# Altium schematic sheet SH1 - POWER.SchDoc: Power
size Letter; DrawnBy: Ayesha Ebrahim; SheetNumber: 5; SheetTotal: 6
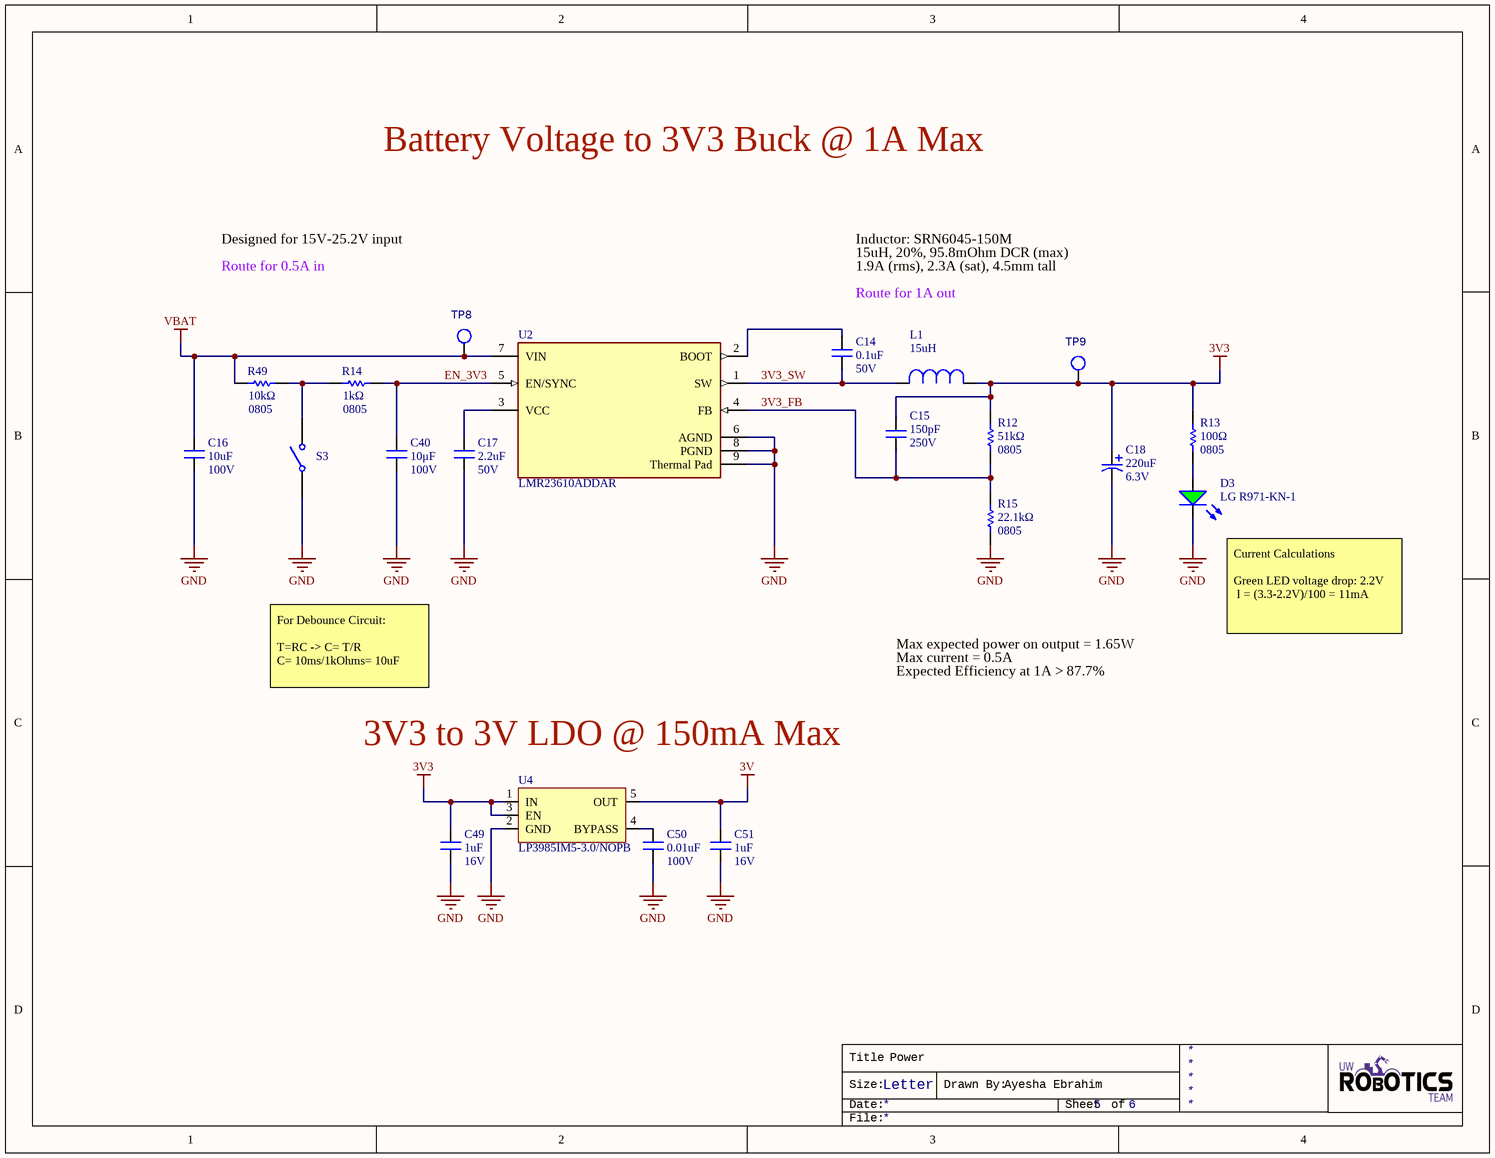
[diagram p0: SH1 - POWER.SchDoc]

## Parts
C14  value 0.1uF  Voltage Rating: 50V  [CAPC2012X140N]  (hidden comment: CAP_0.1uF_50V_0805)
C15  value 150pF  Voltage Rating: 250V  [CAPC2012X140N]  (hidden comment: CAP_150pF_250V_0805)
C16  value 10uF  Voltage Rating: 100V  [CAPC1210(3225)]  (hidden comment: CAP_10uF_100V_1210)
C17  value 2.2uF  Voltage Rating: 50V  [CAPC1206(3216)]  (hidden comment: CAP_2.2uF_50V_1206)
C18  value 220uF  Voltage Rating: 6.3V  [PCAP_SVP_B6_PA00]  (hidden comment: CAP_220uF_6.3V_SMD)
C40  value 10μF  Voltage Rating: 100V  [CAPC1210(3225)]  (hidden comment: CAP_10uF_100V_1210)
C49  value 1uF  Voltage Rating: 16V  [CAPC2012X140N]  (hidden comment: CAP_1uF_16V_0805)
C50  value 0.01uF  Voltage Rating: 100V  [CAPC2012X140N]  (hidden comment: CAP_0.01uF_100V_0805)
C51  value 1uF  Voltage Rating: 16V  [CAPC2012X140N]  (hidden comment: CAP_1uF_16V_0805)
D3  Manufacturer Part Number 1: LG R971-KN-1  [LED_0805_LINE]  (hidden comment: DIO_LED_G)
L1  Inductance: 15uH  [IND_BOURNS_SRN6045]  (hidden comment: SRN6045-150M)
R12  value 51kΩ  Case Code (Imperial): 0805  [RESC2012X60N]  (hidden comment: RES_51kΩ_0805)
R13  value 100Ω  Case Code (Imperial): 0805  [RESC2012X60N]  (hidden comment: RES_100Ω_0805)
R14  value 1kΩ  Case Code (Imperial): 0805  [RESC2012X60N]
R15  Case Code (Imperial): 0805  Resistance: 22.1kΩ  [RESC2012X60N]  (hidden comment: RES_22.1kΩ_0805)
R49  value 10kΩ  Case Code (Imperial): 0805  [RESC2012X60N]  (hidden comment: RES_10kΩ_0805)
S3  GF-123-0054  [GF1230054]  (value not drawn)
TP8  TESTPOINT_LOOP  [TESTPOINT_LOOP]  (value not drawn)
TP9  TESTPOINT_LOOP  [TESTPOINT_LOOP]  (value not drawn)
U2  LMR23610ADDAR  [8-SO PowerPad]
U4  LP3985IM5-3.0/NOPB  [SOT23-5]

## Nets
3V: C51.2 U4.5(OUT)
3V3: C15.1 C18.1 C49.2 L1.1 R12.2 R13.2 TP9.1 U4.1(IN) U4.3(EN)
GND: C16.1 C17.1 C18.2 C40.1 C49.1 C50.1 C51.1 D3.2(K) R15.1 S3.1 U2.6(AGND) U2.8(PGND) U2.9(Thermal_Pad) U4.2(GND)
VBAT: C16.2 R49.1 TP8.1 U2.7(VIN)
3V3_FB: C15.2 R12.1 R15.2 U2.4(FB)
3V3_SW: C14.1 L1.2 U2.1(SW)
EN_3V3: C40.2 R14.2 U2.5(EN/SYNC)
NetC14_2: C14.2 U2.2(BOOT)
NetC17_2: C17.2 U2.3(VCC)
NetC50_2: C50.2 U4.4(BYPASS)
NetD3_1: D3.1(A) R13.1
NetR14_1: R14.1 R49.2 S3.2

## Notes on the sheet
- Battery Voltage to 3V3 Buck @ 1A Max
- Designed for 15V-25.2V input
- Route for 0.5A in
- Inductor: SRN6045-150M
- 15uH, 20%, 95.8mOhm DCR (max)
- 1.9A (rms), 2.3A (sat), 4.5mm tall
- (near C14) Route for 1A out
- (near D3) Current Calculations
  Green LED voltage drop: 2.2V
  I = (3.3-2.2V)/100 = 11mA
- For Debounce Circuit:
  T=RC -> C= T/R
  C= 10ms/1kOhms= 10uF
- Max expected power on output = 1.65W
- Max current = 0.5A
- Expected Efficiency at 1A > 87.7%
- (near U4) 3V3 to 3V LDO @ 150mA Max
- Title
- Size:
- Date:
- Letter
- Drawn By:
- Sheet
- of
- File:

## Library data of the parts
C14 = CAP_0.1uF_50V_0805: CAP CER 0.1UF 50V X7R 0805; Manufacturer 1: Murata Electronics; Manufacturer Part Number 1: GCD21BR71H104KA01L; Capacitance: 100nF; Tolerance: 10%; Mount: Surface Mount; Case/Package: 0805; Case Code (Metric): 2012; Case Code (Imperial): 0805; Min Operating Temperature: -55°C; Max Operating Temperature: 125°C; Dielectric: X7R; Termination: SMD/SMT; Length: 2mm; Height: 1.25mm; Width: 0.049inch; Thickness: 0.049inch; Depth: 1.25mm; Ratings: AEC-Q200; ComponentLink1URL: https://datasheet.ciiva.com/29537/c03e-29537701.pdf?src-supplier=Digi-Key; ComponentLink1Description: https://datasheet.ciiva.com/29537/c03e-29537701.pdf?src-supplier=Digi-Key; Supplier 1: Digi-Key; Supplier Part Number 1: 490-11955-1-ND
C15 = CAP_150pF_250V_0805: CAP CER 150PF 250V C0G/NP0 0805; Manufacturer 1: Murata Electronics; Manufacturer Part Number 1: GRM21A5C2E151JW01D; Tolerance: 5%; Dielectric: C0G, NP0; Mount: Surface Mount; Case/Package: 0805; Case Code (Metric): 2012; Case Code (Imperial): 0805; Min Operating Temperature: -55°C; Max Operating Temperature: 125°C; Capacitance: 150pF; Termination: SMD/SMT; Width: 0.049inch; Supplier 1: Digi-Key; Supplier Part Number 1: 490-12755-1-ND
C16 = CAP_10uF_100V_1210: CAP CER 10UF 100V X7S 1210; Manufacturer Part Number 1: GRM32EC72A106KE05L; Manufacturer 1: Murata Electronics; Package: 1210 (3225 Metric); Temperature Coefficient: X7S; Supplier Part Number 1: 490-16266-2-ND; Supplier 1: Digi-Key; Mount: Surface Mount
C17 = CAP_2.2uF_50V_1206: CAP CER 2.2UF 50V X7R 1206; Manufacturer 1: Murata Electronics; Manufacturer Part Number 1: GCM31CR71H225KA55L; Tolerance: 10%; Supplier Part Number 1: 490-4796-1-ND; Supplier 1: Digi-Key; RoHS: Yes; Category: Ceramic Capacitors; Stock 2: 102080; Pricing 2: 1=0.54000, 10=0.38400, 100=0.25300, 500=0.18742, 1000=0.15931 (USD); Case/Package: 1206; Case Code (Imperial): 1206; Case Code (Metric): 3216; Min Operating Temperature: -55°C; Max Operating Temperature: 125°C; Capacitance: 2.2uF; Dielectric: X7R; Packaging: Tape and Reel; Voltage Rating (DC): 50V; Package Quantity: 1; Termination: SMD/SMT; Voltage: 50V; Length: 3.2mm; Height: 1.6mm; Width: 1.6mm; Thickness: 0.071inch; Depth: 1.6mm; Ratings: AEC-Q200; Radiation Hardening: No; REACH SVHC: No SVHC; Lead Free: Lead Free
C18 = CAP_220uF_6.3V_SMD: CAP ALUM POLY 220UF 20% 6.3V SMD; Manufacturer Part Number 1: 6SVPE220MW; Manufacturer 1: Panasonic Electronic Components; Package: Radial, Can - SMD; Supplier Part Number 1: P16836CT-ND; Supplier 1: Digi-Key; Mount: Surface Mount
C40 = CAP_10uF_100V_1210: CAP CER 10uF 100V X7S 10% 1210; Manufacturer 1: Murata; Manufacturer Part Number 1: GRM32EC72A106KE05L; Supplier 1: Digi-Key; Category: Ceramic Capacitors; Mount: Surface Mount; Case Code (Imperial): 1210; Case Code (Metric): 3225; Min Operating Temperature: -55°C; Max Operating Temperature: 125°C; Tolerance: 10%; Supplier Part Number 1: 490-16266-1-ND; Dielectric: X7S; Package: 1210 (3225 Metric)
C49 C51 = CAP_1uF_16V_0805: CAP CER 1UF 16V X7R 0805; Manufacturer 1: Yageo; Manufacturer Part Number 1: CC0805KKX7R7BB105; Tolerance: 10%; Mount: Surface Mount; Case/Package: 0805; Case Code (Metric): 2012; Case Code (Imperial): 0805; Min Operating Temperature: -55°C; Max Operating Temperature: 125°C; Capacitance: 1uF; Dielectric: X7R; Termination: SMD/SMT; Supplier 1: Digi-Key; Supplier Part Number 1: 311-1365-1-ND
C50 = CAP_0.01uF_100V_0805: CAP CER 10000PF 100V X7R 0805; Manufacturer 1: KEMET; Manufacturer Part Number 1: C0805C103K1RACTU; Tolerance: 10%; Mount: Surface Mount; Case/Package: 0805; Case Code (Metric): 2012; Case Code (Imperial): 0805; Min Operating Temperature: -55°C; Max Operating Temperature: 125°C; Dielectric: X7R; Termination: SMD/SMT; Supplier 1: Digi-Key; Supplier Part Number 1: 399-1159-1-ND
D3 = DIO_LED_G: LED GREEN DIFFUSED 0805 SMD; Manufacturer 1: OSRAM; Forward Voltage Drop: 2.2V; Package: 0805 (2012 Metric); Supplier Part Number 1: 475-1410-1-ND; Supplier 1: Digi-Key; Mount: Surface Mount
L1 = IND_15uH_1.9A: FIXED IND 15UH 1.9A 95.8MOHM SMD; Manufacturer 1: Bourns Inc.; Core Material: Ferrite; DC Resistance (DCR): 95.8mR; Tolerance: 20%; Test Frequency: 100kHz; Shielding: Shielded; Saturation Current: 2.3A; Self Resonant Frequency: 13MHz; Supplier 1: Digi-Key; Manufacturer Part Number 1: SRN6045-150M; RoHS: Yes; Category: Fixed Inductors; Stock 1: 16841; Pricing 1: 1=0.60000, 10=0.52300, 100=0.37380, 500=0.31396 (USD); Mount: Surface Mount; Case/Package: Nonstandard; Number of Pins: 2; Weight: 0.027725oz; Min Operating Temperature: -40°C; Max Operating Temperature: 125°C; Max DC Current: 1.9A; Packaging: Tape and Reel; Termination: SMD/SMT; Composition: Wirewound; DC Current: 1.9A; Military Standard: Not; RMS Current (Irms): 1.9A; Inductance Tolerance: 20%; Package Quantity: 1000; Current Rating: 1.9A; Length: 6mm; Height: 4.5mm; Depth: 6.2mm; Height - Seated (Max): 0.177inch; Width: 6mm; REACH SVHC: No SVHC; ComponentLink1URL: https://datasheet.ciiva.com/5986/1705518-5986195.pdf?src-supplier=Farnell; ComponentLink1Description: https://datasheet.ciiva.com/5986/1705518-5986195.pdf?src-supplier=Farnell; ComponentLink2URL: https://datasheet.ciiva.com/11802/0900766b80fe1f3e-11802573.pdf?src-supplier=RSComponents; ComponentLink2Description: https://datasheet.ciiva.com/11802/0900766b80fe1f3e-11802573.pdf?src-supplier=RSComponents; ComponentLink3URL: https://datasheet.ciiva.com/1056/srn6045-1056107.pdf?src-supplier=Digi-Key; ComponentLink3Description: https://datasheet.ciiva.com/1056/srn6045-1056107.pdf?src-supplier=Digi-Key; ComponentLink4URL: https://datasheet.ciiva.com/8512/srn6045-8512989.pdf?src-supplier=Avnet; ComponentLink4Description: https://datasheet.ciiva.com/8512/srn6045-8512989.pdf?src-supplier=Avnet; ComponentLink5URL: https://datasheet.ciiva.com/17113/70231653-17113165.pdf?src-supplier=Allied+Electronics; ComponentLink5Description: https://datasheet.ciiva.com/17113/70231653-17113165.pdf?src-supplier=Allied+Electronics; ComponentLink6URL: https://datasheet.ciiva.com/17284/srn6045-17284750.pdf?src-supplier=Avnet+Europe; ComponentLink6Description: https://datasheet.ciiva.com/17284/srn6045-17284750.pdf?src-supplier=Avnet+Europe; ComponentLink7URL: https://datasheet.ciiva.com/4954/srn6045-70649-4954231.pdf?src-supplier=Mouser; ComponentLink7Description: https://datasheet.ciiva.com/4954/srn6045-70649-4954231.pdf?src-supplier=Mouser; ComponentLink8URL: https://datasheet.ciiva.com/1056/srn6045-1056106.pdf?src-supplier=Digi-Key; ComponentLink8Description: https://datasheet.ciiva.com/1056/srn6045-1056106.pdf?src-supplier=Digi-Key; ComponentLink9URL: https://datasheet.ciiva.com/1056/srn6045-1056108.pdf?src-supplier=Digi-Key; ComponentLink9Description: https://datasheet.ciiva.com/1056/srn6045-1056108.pdf?src-supplier=Digi-Key; Supplier Part Number 1: SRN6045-150MCT-ND
R12 = RES_51kΩ_0805: RES SMD 51K OHM 1% 1/8W 0805; Manufacturer 1: Vishay Dale; Manufacturer Part Number 1: CRCW080551K0FKEA; Power Rating: 125mW; Supplier 1: Digi-Key; Case Code (Metric): 2012; Min Operating Temperature: -55°C; Max Operating Temperature: 155°C; Resistance: 51K; Tolerance: 1%; Termination: SMD/SMT; Supplier Part Number 1: 541-51.0KCCT-ND
R13 = RES_100Ω_0805: RES SMD 100 OHM 1% 1/8W 0805; Manufacturer 1: Yageo; Manufacturer Part Number 1: RC0805FR-07100RL; Power Rating: 125mW; Supplier 1: Digi-Key; Mount: Surface Mount; Case Code (Metric): 2012; Supplier Part Number 1: 311-100CRCT-ND
R14 = RES_1kΩ_0805: RES SMD 1K OHM 1% 1/8W 0805; Manufacturer 1: Yageo; Manufacturer Part Number 1: RC0805FR-071KL; Power Rating: 125mW; Temperature Coefficient: 25ppm/°C; Voltage Rating: 150V; Supplier 1: Digi-Key; Case Code (Metric): 2012; Min Operating Temperature: -55°C; Max Operating Temperature: 155°C; Resistance: 1K; Tolerance: 1%; Termination: SMD/SMT; Supplier Part Number 1: 311-1.00KCRCT-ND; Package: 0805 (2012 Metric); Mount: Surface Mount; Case/Package: 0805; Number of Pins: 2; Weight: 0.000194oz; Contact Plating: Tin; Composition: Thin Film; Number of Terminations: 2; Voltage Rating (DC): 150V; Max Power Dissipation: 125mW; Features: Moisture Resistant,Automotive AEC-Q200,Anti-Sulfur; Military Standard: Not; Length: 2mm; Height: 0.022inch; Width: 0.049inch; Depth: 1.25mm; REACH SVHC: Unknown
R15 = RES_22.1kΩ_0805: RES SMD 22.1K OHM 1% 1/8W 0805; Manufacturer 1: Vishay Dale; Manufacturer Part Number 1: CRCW080522K1FKEA; Power Rating: 125mW; Supplier 1: Digi-Key; Case Code (Metric): 2012; Min Operating Temperature: -55°C; Max Operating Temperature: 155°C; Tolerance: 1%; Termination: SMD/SMT; Supplier Part Number 1: 541-22.1KCCT-ND
R49 = RES_10kΩ_0805: RES SMD 10K OHM 1% 1/8W 0805; Manufacturer 1: Yageo; Manufacturer Part Number 1: RC0805FR-0710KL; Power Rating: 125mW; Supplier 1: Digi-Key; Case Code (Metric): 2012; Min Operating Temperature: -55°C; Max Operating Temperature: 155°C; Resistance: 10K; Tolerance: 1%; Termination: SMD/SMT; Supplier Part Number 1: 311-10.0KCRCT-ND; Package: 0805 (2012 Metric)
S3 = GF-123-0054: SWITCH SLIDE SPST 500mA (DC) 8.5A (AC) 125V; Manufacturer 1: CW Industries; Supplier 1: Digi-Key; Supplier Part Number 1: CWI333-ND; Manufacturer Part Number 1: GF-123-0054; Voltage Rating: 125V; Current Rating: 500mA
TP8 TP9 = TESTPOINT_LOOP: Loop testpoint through-hole pad; Manufacturer Part Number 1: 5002; Manufacturer 1: Keystone Electronics; Supplier Part Number 1: 36-5002-ND; Supplier 1: Digi-Key; Mount: Through Hole
U2 = BUCK_1-28VOUT_1A: IC REG BUCK ADJUSTABLE 1A 8SOPWR; Manufacturer 1: Texas Instruments; Output Voltage: 1-28V; Number Of Outputs: 1; Nominal Supply Current: 75uA; Switching Frequency: 400kHz; Standoff Height: 0mm; Max Duty Cycle: 97%; Max Supply Voltage: 36V; Min Supply Voltage: 4V; Max Junction Temp: +125°C; Output Type: AdjustableProgrammable; Temperature Range High: +125°C; Automotive: No; RoHS: TRUE; Category: IC; Output Current: 1A; Temperature Range Low: -40°C; Package: DDA0008E; Manufacturer Part Number 1: LMR23610ADDAR; ComponentLink2Description: Datasheet; Height: 1.7mm; Device Class L3: Voltage Regulators - Switching; Device Class L1: Integrated Circuits (ICs); ComponentLink2URL: http://www.ti.com/lit/ds/symlink/lmr23610.pdf; Temperature: -40°C to +125°C; Lead Free: Yes; Device Class L2: Power Management ICs; Digikey Description: IC REG BUCK ADJUSTABLE 1A 8SOPWR; Octopart: https://octopart.com/lmr23610addar-texas+instruments-68058948; Switching Topology: Buck; Supplier 1: Digi-Key; Supplier Part Number 1: 296-47267-1-ND
U4 = LP3985IM5-3.0/NOPB: IC REG LINEAR 3V 150MA SOT23-5; Manufacturer 1: Texas Instruments; Manufacturer Part Number 1: LP3985IM5-3.0/NOPB; Current Output: 150mA; Supplier Part Number 1: LP3985IM5-3.0/NOPBTR-ND; Supplier 1: Digi-Key; Mount: Surface Mount